# Altium schematic sheet Schematics.SchDoc
size A3; SheetNumber: 1; SheetTotal: 1
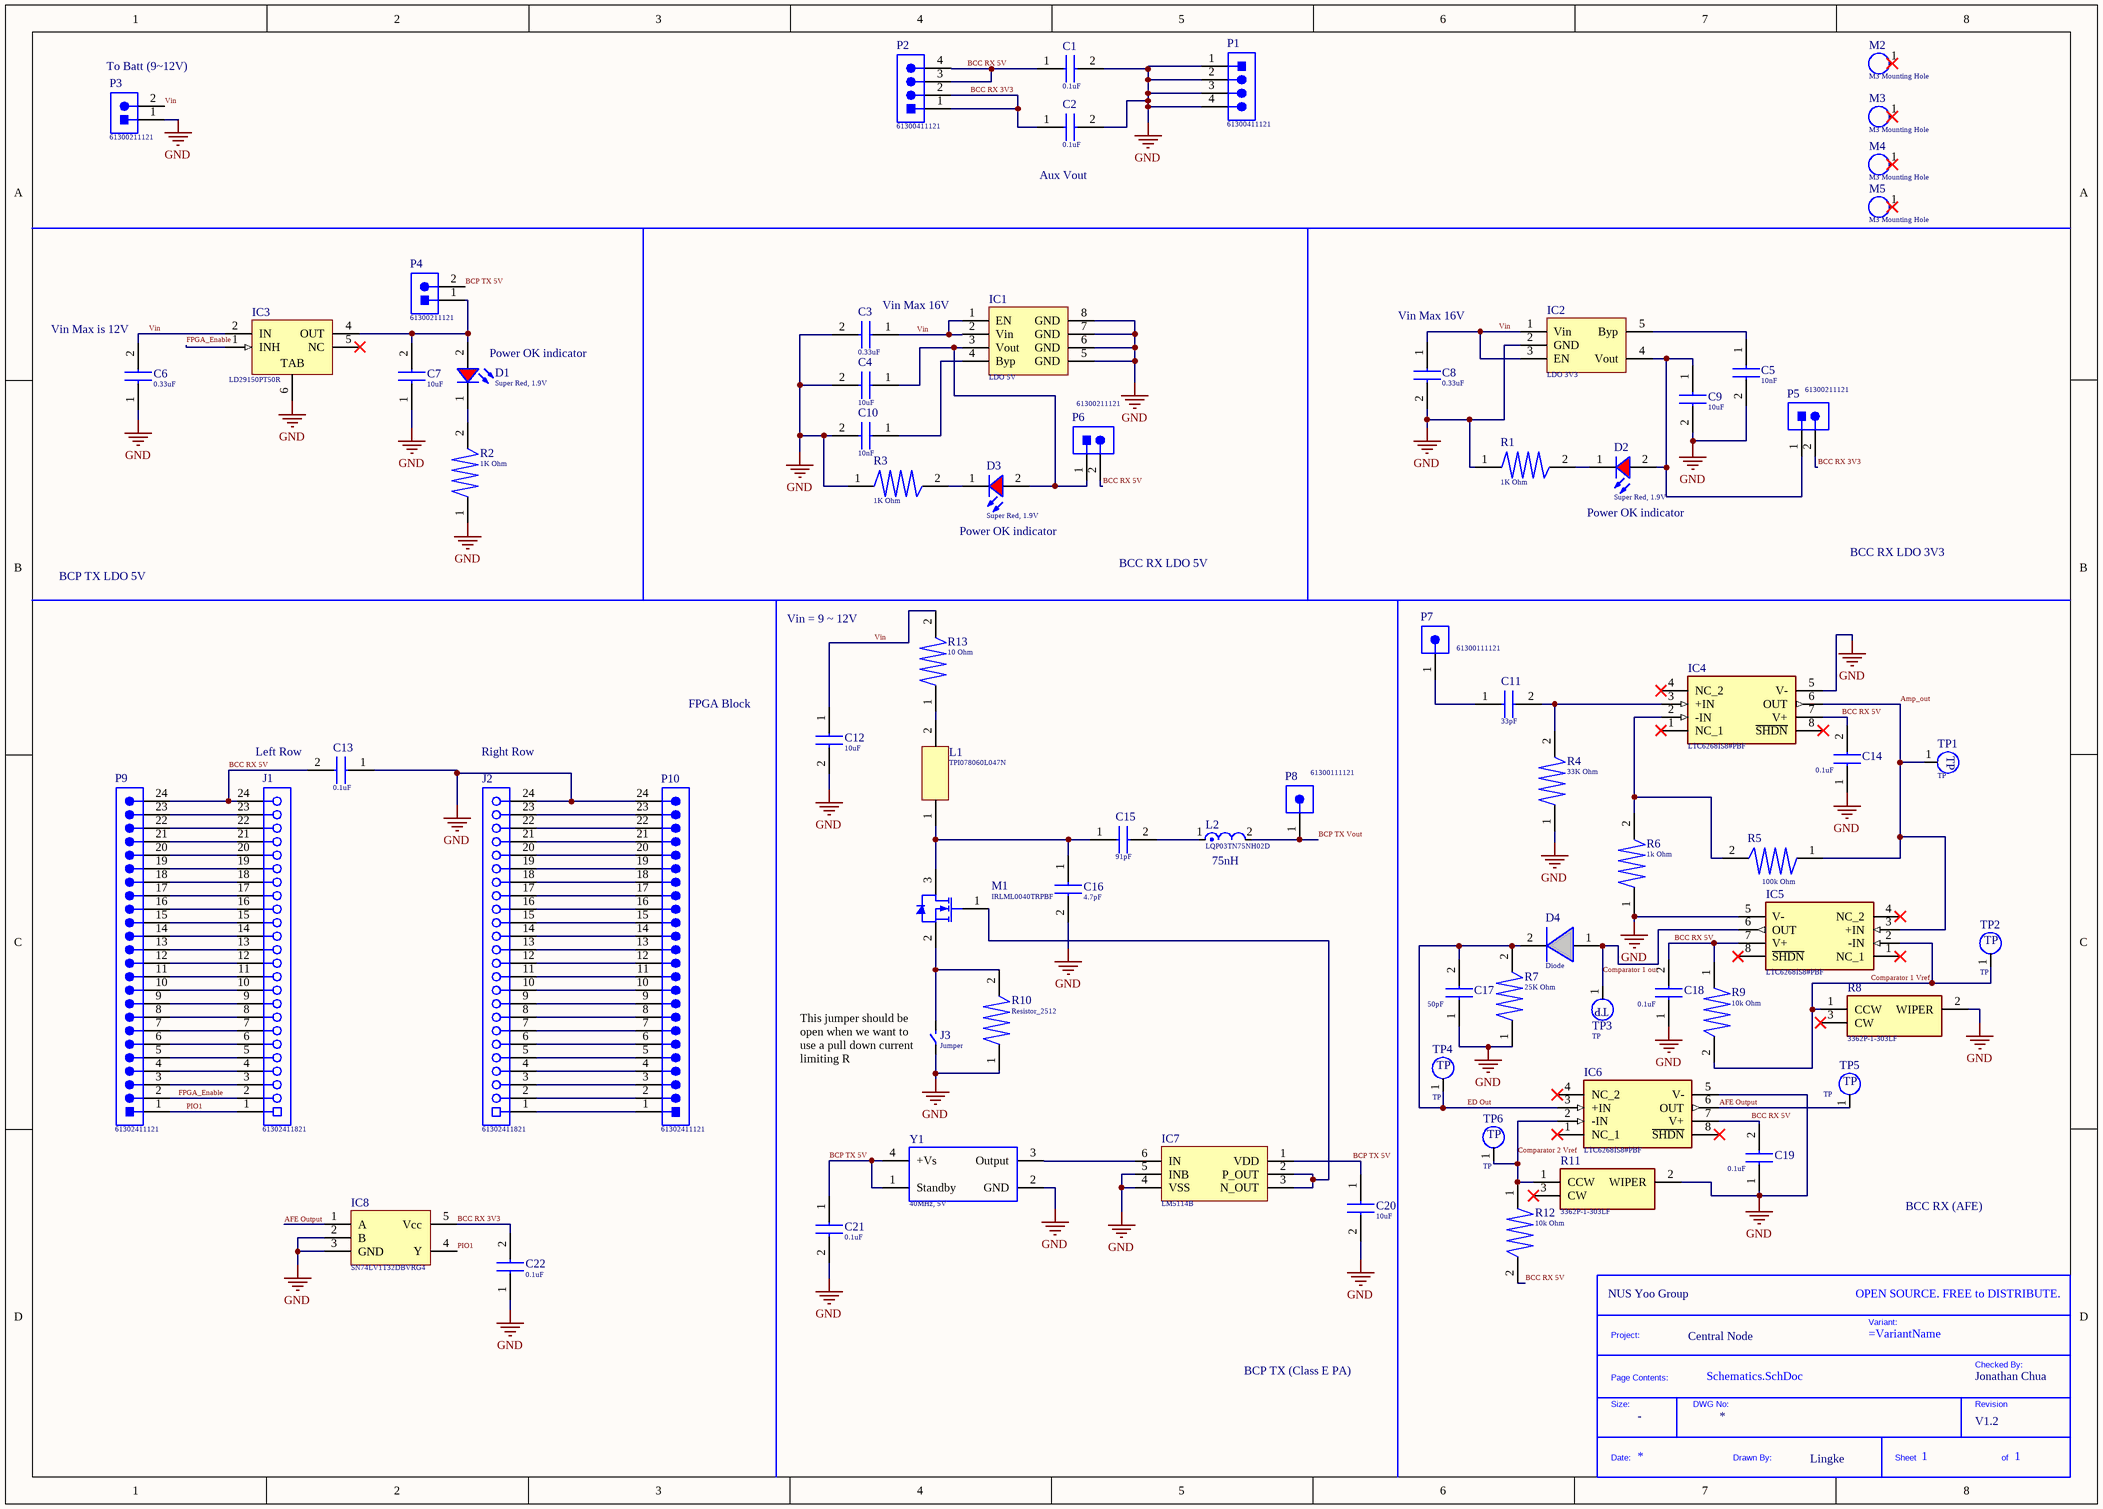
[diagram p0: Schematics.SchDoc]

## Parts
*  Project Name: Central Node  Company: NUS Yoo Group  Drawn By: Lingke  Revision: V1.2  Checked By: Jonathan Chua  (hidden comment: Title_Block)  (no BOM)
C1  0.1uF  [0603]
C2  0.1uF  [0603]
C3  0.33uF  [0603]
C4  10uF  [0603]
C5  10nF  [0603]
C6  0.33uF  [0603]
C7  10uF  [0603]
C8  0.33uF  [0603]
C9  10uF  [0603]
C10  10nF  [0603]
C11  33pF  [0603]
C12  10uF  [0603]
C13  0.1uF  [0603]
C14  0.1uF  [0603]
C15  91pF  [0603]
C16  4.7pF  [0603]
C17  50pF  [0603]
C18  0.1uF  [0603]
C19  0.1uF  [0603]
C20  10uF  [0603]
C21  0.1uF  [0603]
C22  0.1uF  [0603]
D1  Super Red, 1.9V  [WL-SMCW_0603_H=0.7mm]
D2  Super Red, 1.9V  [WL-SMCW_0603_H=0.7mm]
D3  Super Red, 1.9V  [WL-SMCW_0603_H=0.7mm]
D4  Diode  [0603]
IC1  LDO 5V  [SOIC-8]
IC2  LDO 3V3  [SOT-23-5]
IC3  LD29150PT50R  [PPAK_L]
IC4  LTC6268IS8#PBF  [SOIC127P599X175-8N]
IC5  LTC6268IS8#PBF  [SOIC127P599X175-8N]
IC6  LTC6268IS8#PBF  [SOIC127P599X175-8N]
IC7  LM5114B  [SOT-23-6]
IC8  SN74LV1T32DBVRG4  [SOT-23-5]
J1  61302411821  [61302411821]
J2  61302411821  [61302411821]
J3  Jumper  [0603]
L1  TPI078060L047N  [TPI078060L047N]
L2  LQP03TN75NH02D  [FP-LQP03PN_02-IPC_A]
M1  IRLML0040TRPBF  [SOT-23]
M2  M3 Mounting Hole  [M3 Hole]
M3  M3 Mounting Hole  [M3 Hole]
M4  M3 Mounting Hole  [M3 Hole]
M5  M3 Mounting Hole  [M3 Hole]
P1  61300411121  [61300411121]
P2  61300411121  [61300411121]
P3  61300211121  [61300211121]
P4  61300211121  [61300211121]
P5  61300211121  [61300211121]
P6  61300211121  [61300211121]
P7  61300111121  [61300111121]
P8  61300111121  [61300111121]
P9  61302411121  [61302411121]
P10  61302411121  [61302411121]
R1  1K Ohm  [0603]
R2  1K Ohm  [0603]
R3  1K Ohm  [0603]
R4  33K Ohm  [0603]
R5  100k Ohm  [0603]
R6  1k Ohm  [0603]
R7  25K Ohm  [0603]
R8  3362P-1-303LF  [3362P_1]
R9  10k Ohm  [0603]
R10  Resistor_2512  [2512]
R11  3362P-1-303LF  [3362P_1]
R12  10k Ohm  [0603]
R13  10 Ohm  [2512]
TP1  TP  [Test Point]  (no BOM)
TP2  TP  [Test Point]  (no BOM)
TP3  TP  [Test Point]  (no BOM)
TP4  TP  [Test Point]  (no BOM)
TP5  TP  [Test Point]  (no BOM)
TP6  TP  [Test Point]  (no BOM)
Y1  40MHz, 5V  [WE-SPXO_CFPS-72]

## Nets
GND: C1.2 C2.2 C3.2 C4.2 C5.2 C6.1 C7.1 C8.2 C9.2 C10.2 C12.2 C13.1 C14.1 C16.2 C17.1 C18.1 C19.1 C20.2 C21.2 C22.1 IC1.5(GND) IC1.6(GND) IC1.7(GND) IC1.8(GND) IC2.2(GND) IC3.6(TAB) IC4.5(V-) IC5.5(V-) IC6.5(V-) IC7.4(VSS) IC7.5(INB) IC8.2(B) IC8.3(GND) J2.24 J3.1 P1.1 P1.2 P1.3 P1.4 P3.1 P10.24 R1.1 R2.1 R3.1 R4.1 R6.1 R7.1 R8.2(WIPER) R10.1 R11.2(WIPER) Y1.2(GND)
AFE Output: IC6.6(OUT) IC8.1(A) TP5.1(TP)
Amp_out: IC4.6(OUT) IC5.3(+IN) R5.1 TP1.1(TP)
BCC RX 3V3: C2.1 C22.2 IC8.5(Vcc) P2.1 P2.2 P5.2
BCC RX 5V: C1.1 C13.2 C14.2 C18.2 C19.2 IC4.7(V+) IC5.7(V+) IC6.7(V+) J1.24 P2.3 P2.4 P6.2 P9.24 R9.1 R12.2
BCP TX 5V: C20.1 C21.1 IC7.1(VDD) P4.2 Y1.1(Standby) Y1.4(+Vs)
BCP TX Vout: L2.2 P8.1
Comparator 1 out: D4.1 IC5.6(OUT) TP3.1(TP)
Comparator 1 Vref: IC5.2(-IN) R8.1(CCW) R9.2 TP2.1(TP)
Comparator 2 Vref: IC6.2(-IN) R11.1(CCW) R12.1 TP6.1(TP)
ED Out: C17.2 D4.2 IC6.3(+IN) R7.2 TP4.1(TP)
FPGA_Enable: IC3.1(INH) J1.2 P9.2
PIO1: IC8.4(Y) J1.1 P9.1
Vin: C3.1 C6.2 C8.1 C12.1 IC1.1(EN) IC1.2(Vin) IC2.1(Vin) IC2.3(EN) IC3.2(IN) P3.2 R13.2
NetC4_1: C4.1 D3.2(A) IC1.3(Vout) P6.1
NetC5_1: C5.1 IC2.5(Byp)
NetC7_2: C7.2 D1.2(A) IC3.4(OUT) P4.1
NetC9_1: C9.1 D2.2(A) IC2.4(Vout) P5.1
NetC10_1: C10.1 IC1.4(Byp)
NetC11_1: C11.1 P7.1
NetC11_2: C11.2 IC4.3(+IN) R4.2
NetC15_1: C15.1 C16.1 L1.1 M1.3(D)
NetC15_2: C15.2 L2.1
NetD1_1: D1.1(K) R2.2
NetD2_1: D2.1(K) R1.2
NetD3_1: D3.1(K) R3.2
NetIC4_2: IC4.2(-IN) R5.2 R6.2
NetIC7_2: IC7.2(P_OUT) IC7.3(N_OUT) M1.1(G)
NetIC7_6: IC7.6(IN) Y1.3(Output)
NetJ1_3: J1.3 P9.3
NetJ1_4: J1.4 P9.4
NetJ1_5: J1.5 P9.5
NetJ1_6: J1.6 P9.6
NetJ1_7: J1.7 P9.7
NetJ1_8: J1.8 P9.8
NetJ1_9: J1.9 P9.9
NetJ1_10: J1.10 P9.10
NetJ1_11: J1.11 P9.11
NetJ1_12: J1.12 P9.12
NetJ1_13: J1.13 P9.13
NetJ1_14: J1.14 P9.14
NetJ1_15: J1.15 P9.15
NetJ1_16: J1.16 P9.16
NetJ1_17: J1.17 P9.17
NetJ1_18: J1.18 P9.18
NetJ1_19: J1.19 P9.19
NetJ1_20: J1.20 P9.20
NetJ1_21: J1.21 P9.21
NetJ1_22: J1.22 P9.22
NetJ1_23: J1.23 P9.23
NetJ2_1: J2.1 P10.1
NetJ2_2: J2.2 P10.2
NetJ2_3: J2.3 P10.3
NetJ2_4: J2.4 P10.4
NetJ2_5: J2.5 P10.5
NetJ2_6: J2.6 P10.6
NetJ2_7: J2.7 P10.7
NetJ2_8: J2.8 P10.8
NetJ2_9: J2.9 P10.9
NetJ2_10: J2.10 P10.10
NetJ2_11: J2.11 P10.11
NetJ2_12: J2.12 P10.12
NetJ2_13: J2.13 P10.13
NetJ2_14: J2.14 P10.14
NetJ2_15: J2.15 P10.15
NetJ2_16: J2.16 P10.16
NetJ2_17: J2.17 P10.17
NetJ2_18: J2.18 P10.18
NetJ2_19: J2.19 P10.19
NetJ2_20: J2.20 P10.20
NetJ2_21: J2.21 P10.21
NetJ2_22: J2.22 P10.22
NetJ2_23: J2.23 P10.23
NetJ3_2: J3.2 M1.2(S) R10.2
NetL1_2: L1.2 R13.1

Not connected (* = marked no-connect by the designer): IC3 5(NC)*; IC4 1(NC_1)* 4(NC_2)* 8(~{SHDN})*; IC5 1(NC_1)* 4(NC_2)* 8(~{SHDN})*; IC6 1(NC_1)* 4(NC_2)* 8(~{SHDN})*; M2 1*; M3 1*; M4 1*; M5 1*; R8 3(CW)*; R11 3(CW)*

## Notes on the sheet
- (near P3) To Batt (9~12V)
- (near C2) Aux Vout
- (near C3) Vin Max 16V
- (near C6) Vin Max is 12V
- (near D1) Power OK indicator
- (near C8) Vin Max 16V
- Power OK indicator
- BCP TX LDO 5V
- BCC RX LDO 5V
- BCC RX LDO 3V3
- Vin = 9 ~ 12V
- FPGA Block
- Left Row
- (near J2) Right Row
- (near L2) 75nH
- (near J3) This jumper should be open when we want to use a pull down current limiting R
- BCC RX (AFE)
- BCP TX (Class E PA)
- (in symbol Title_Block) OPEN SOURCE. FREE to DISTRIBUTE.; Variant:; Project:; Checked By:; Page Contents:; Size:; DWG No:; Revision; Date:; Drawn By:; Sheet; of

## Library data of the parts
* = Title_Block: Standard Title Block.; DWG No: *; Size: -
C1-C22 = Capacitor_0603: Capacitor
D1-D3 = 150060SS75000: WL-SMCW SMT Mono-color Chip LED Waterclear, size 0603, Super Red, 1.9V, 140deg; Chip Technology: AlInGaP; Dominant Wavelength typ.: 630nm; Luminous Intensity typ.: 60mcd; Peak Wavelength typ.: 645nm; Viewing Angle: 140deg; ComponentLink1Description: Manufacturer; ComponentLink1URL: http://www.we-online.de; ComponentLink2URL: https://www.we-online.com/catalog/datasheet/150060SS75000.pdf; ComponentLink2Description: Datasheet; Forward Voltage typ.: 1.9V; Emitting Color: Super Red; Mounting Technology: SMT; Operating Temperature: -40 to +85degC; Published Date: December 2019; Part Number: 150060SS75000; Packaging: Tape and Reel; Size: 0603; Publisher: Wurth Elektronik
IC1 = SPX3819S-L-5-0/TR
IC2 = SPX3819M5-L-3-3/TR
IC3 = LD29150PT50R: 1.5A, Very-Low Drop Voltage Regulator, 5V, 5-Pin PPAK; ComponentLink1URL: http://www.st.com; PackageReference: PPAK; ComponentLink1Description: Manufacturer URL; PackageDescription: 5-Pin Transistor Outline Package 1.27 mm Pitch, 9.7 mm Lead Span; ComponentLink2URL: http://www.st.com/internet/com/TECHNICAL_RESOURCES/TECHNICAL_LITERATURE/DATASHEET/CD00003403.pdf; DatasheetVersion: 27/10/2010; ComponentLink2Description: Datasheet; PackageVersion: 1/06/2004
IC4-IC6 = LTC6268IS8#PBF: Integrated Circuit; Manufacturer_Name: Linear Technology; Datasheet Link: https://componentsearchengine.com//LTC6268IS8#PBF.pdf; Height: 1.752mm; Mouser2 Part Number: 584-LTC6268IS8#PBF; Mouser2 Price/Stock: https://www.mouser.com/Search/Refine.aspx?Keyword=584-LTC6268IS8%23PBF; Manufacturer_Part_Number: LTC6268IS8#PBF
J1 J2 = 61302411821: WR-PHD Socket Header, THT, pitch 2.54mm, Single Row, Vertical, 24p; Manufacturer: Wurth Elektronik; Pin Number: 24; Rated Current: 3A; Working Voltage: 250VAC; Withstanding Voltage: 500VAC; Contact Resistance: 20mOhm; ComponentLink1Description: Manufacturer; ComponentLink1URL: http://www.we-online.de; ComponentLink2Description: Datasheet; ComponentLink2URL: https://www.we-online.com/catalog/datasheet/61302411821.pdf; Manufacturer Part Number: 61302411821; Pitch: 2.54mm; Operating Temperature: -40 to +125degC; Mounting Technology: THT; Packaging: Tray; Gender: Socket Header; Row Number: Single; Orientation: Vertical
J3 = 0603_Jumper: Capacitor
L2 = LQP03TN75NH02D: Film type RF Inductor 75nH ±3% 100mA 10Ω 0201 (0603); Shielding: Unshielded; Self Resonant Frequency: 1GHz; Core Material: Non-Magnetic; DC Resistance (DCR): 10R; Test Frequency: 300MHz; Q Factor: 8; Termination: SMD/SMT; Max DC Current: 100mA; Mount: Surface Mount; Width: 0.012inch; Max Operating Temperature: 125°C; Packaging: Tape and Reel; Current Rating: 100mA; Weight: 6E-06oz; RoHS Compliant: Yes; Min Operating Temperature: -55°C; Case/Package: 0201; Resistor Type: Thin Film; Inductance: 75nH; Tolerance: 3%; Package Quantity: 15000; Height: 0.3mm; Case Code (Imperial): 0201; Case Code (Metric): 0603; Length: 0.024inch; Height - Seated (Max): 0.013inch; Supplier 1: Digi-Key; Supplier Part Number 1: 490-13018-1-ND
M1 = IRLML0040TRPBF: HEXFET(R) Power MOSFET, 40 V, -55 to 150 degC, 3-Pin SOT-23, RoHS, Tape and Reel; Manufacturer: International Rectifier; Minimum Gate Threshold Voltage: 1V; Transistor Configuration: Single; Typical Turn-Off Delay Time: 6.4ns; Maximum Gate Threshold Voltage: 2.5V; Channel Type: N; Maximum Gate Source Voltage: ±16V; Channel Mode: Enhancement; Number of Elements per Chip: 1; Maximum Continuous Drain Current: 3.6A; Typical Turn-On Delay Time: 5.1ns; Transistor Material: Si; Typical Input Capacitance @ Vds: 266pF@25V; Maximum Drain Source Resistance: 0.056Ω; Typical Gate Charge @ Vgs: 2.6nC@4.5V; Maximum Power Dissipation: 1.3W; Maximum Drain Source Voltage: 40V; Length: 3.04mm; Height: 1.02mm; Category: PowerMOSFET; Width: 1.4mm; Package Description: 3-Pin Small Outline Transistor, Body 2.92 x 1.3 mm, Pitch 0.95 mm; Pin Count: 3; Package Reference: SOT-23; Datasheet Version: 02/2012; Package Type: SOT-23; Manufacturer URL: http://internationalrectifier.com/; Mounting Technology: SurfaceMount; Dimensions: 3.04x1.4x1.02mm; Maximum Operating Temperature: +150°C; Minimum Operating Temperature: -55°C; Datasheet URL: https://datasheet.ciiva.com/22709/irlml0040pbf-22709201.pdf; Mounting Type: SurfaceMount
M2-M5 = M3_Mounting_hole
P1 P2 = 61300411121: WR-PHD Pin Header, THT, pitch 2.54mm, Single Row, Vertical, 4p; Manufacturer: Wurth Elektronik; Pin Number: 4; Rated Current: 3A; Working Voltage: 250VAC; Withstanding Voltage: 500VAC; Contact Resistance: 20mOhm; ComponentLink1Description: Manufacturer; ComponentLink1URL: http://www.we-online.de; ComponentLink2Description: Datasheet; ComponentLink2URL: https://www.we-online.com/catalog/datasheet/61300411121.pdf; Manufacturer Part Number: 61300411121; Pitch: 2.54mm; Operating Temperature: -40 to +105degC; Mounting Technology: THT; Packaging: Bag; Gender: Pin Header; Row Number: Single; Orientation: Vertical
P3-P6 = 61300211121: WR-PHD Pin Header, THT, pitch 2.54mm, Single Row, Vertical, 2p; Manufacturer: Wurth Elektronik; Pin Number: 2; Rated Current: 3A; Working Voltage: 250VAC; Withstanding Voltage: 500VAC; Contact Resistance: 20mOhm; ComponentLink1Description: Manufacturer; ComponentLink1URL: http://www.we-online.de; ComponentLink2Description: Datasheet; ComponentLink2URL: https://www.we-online.com/catalog/datasheet/61300211121.pdf; Manufacturer Part Number: 61300211121; Pitch: 2.54mm; Operating Temperature: -40 to +105degC; Mounting Technology: THT; Packaging: Bag; Gender: Pin Header; Row Number: Single; Orientation: Vertical
P7 P8 = 61300111121: WR-PHD Pin Header, THT, pitch 2.54mm, Single Row, Vertical, 1p; Manufacturer: Wurth Elektronik; Pin Number: 1; Rated Current: 3A; Working Voltage: 250VAC; Withstanding Voltage: 500VAC; Contact Resistance: 20mOhm; ComponentLink1Description: Manufacturer; ComponentLink1URL: http://www.we-online.de; ComponentLink2Description: Datasheet; ComponentLink2URL: https://www.we-online.com/catalog/datasheet/61300111121.pdf; Manufacturer Part Number: 61300111121; Pitch: 2.54mm; Operating Temperature: -40 to +105degC; Mounting Technology: THT; Packaging: Bag; Gender: Pin Header; Row Number: Single; Orientation: Vertical
P9 P10 = 61302411121: WR-PHD Pin Header, THT, pitch 2.54mm, Single Row, Vertical, 24p; Manufacturer: Wurth Elektronik; Pin Number: 24; Rated Current: 3A; Working Voltage: 250VAC; Withstanding Voltage: 500VAC; Contact Resistance: 20mOhm; ComponentLink1Description: Manufacturer; ComponentLink1URL: http://www.we-online.de; ComponentLink2Description: Datasheet; ComponentLink2URL: https://www.we-online.com/catalog/datasheet/61302411121.pdf; Manufacturer Part Number: 61302411121; Pitch: 2.54mm; Operating Temperature: -40 to +105degC; Mounting Technology: THT; Packaging: Bag; Gender: Pin Header; Row Number: Single; Orientation: Vertical
R1-R7 R9 R12 = Resistor
R8 R11 = 3362P-1-303LF: Resistor; Manufacturer_Name: Bourns; Manufacturer_Part_Number: 3362P-1-303LF
R10 R13 = Resistor_2512: Resistor
TP1-TP6 = Test Point: Test Point 1mm by 1mm
Y1 = 831018739: WE-SPXO Simple Packaged Quartz Oscillator, SMT, CFPS-72, 40MHz, 5V; Manufacturer: Wurth Elektronik; Frequency Stability: +/-50ppm; ComponentLink1URL: http://www.we-online.de; ComponentLink2URL: https://katalog.we-online.com/pbs/datasheet/831018739.pdf; Supply Voltage: 5V; Size: CFPS-72; Packaging: Tape and Reel; Operating Temperature: 0 to +70degC; Mounting Technology: SMT; Published Date: July 2020; ComponentLink1Description: Manufacturer; Manufacturer Part Number: 831018739; Frequency: 40MHz; ComponentLink2Description: Datasheet
IC8 = SN74LV1T32DBVRG4: Supplier 1: Mouser; Supplier Part Number 1: 595-SN74LV1T32DBVRG4
L1 = TPI078060L047N: Supplier 1: Digi-Key; Supplier Part Number 1: 399-TPI078060L047NCT-ND